# EAGLE design observer (EAGLE 6.6.0)
AUTHOR: Brad Campbell, N. Jackson, C. Kreng; REV: A; TITLE: Observer

## Sheet 1 of 2
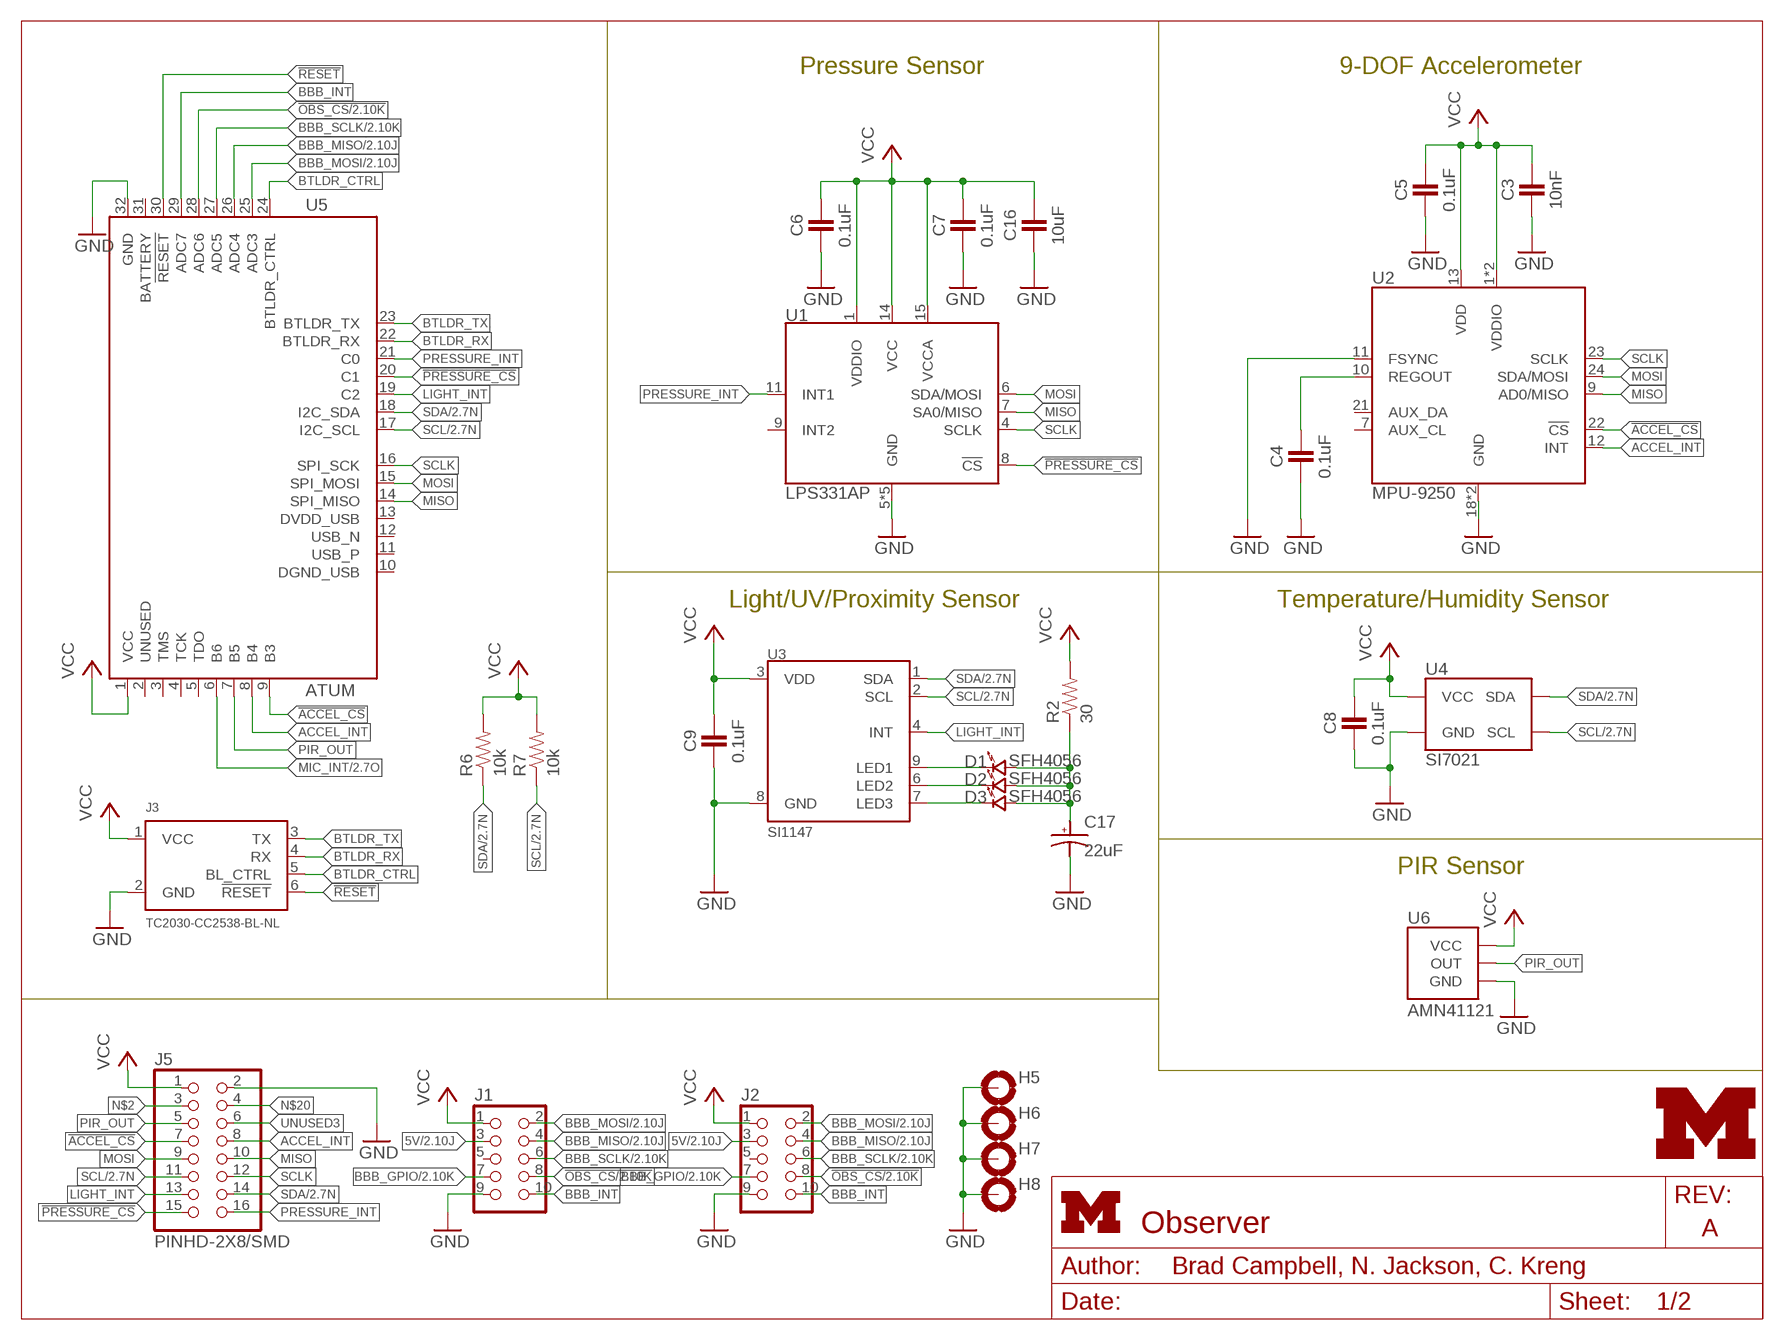
[diagram p0: schematic, sheet 1]
FRAME1 (LETTER_L): HEIGHT: 8.5in; WIDTH: 11in

### Parts
C3  10nF  CAPACITOR  [0402_CAP]
C4  0.1uF  CAPACITOR  [0402_CAP]
C5  0.1uF  CAPACITOR  [0402_CAP]
C6  0.1uF  CAPACITOR  [0402_CAP]
C7  0.1uF  CAPACITOR  [0402_CAP]
C8  0.1uF  CAPACITOR  [0402_CAP]
C9  0.1uF  CAPACITOR  [0402_CAP]
C16  10uF  CAPACITOR  [0402_CAP]
C17  22uF  CAP_POL0603  [CAP0603]
D1  SFH4056  [SFH4056]
D2  SFH4056  [SFH4056]
D3  SFH4056  [SFH4056]
H5  MOUNT-PAD-ROUND3.2  [3,2-PAD]
H6  MOUNT-PAD-ROUND3.2  [3,2-PAD]
H7  MOUNT-PAD-ROUND3.2  [3,2-PAD]
H8  MOUNT-PAD-ROUND3.2  [3,2-PAD]
J1  CON_HEADER_2X05-SMD+SHROUDED  [PINSHRD_SMT_2X05]
J2  CON_HEADER_2X05-SMD+SHROUDED  [PINSHRD_SMT_2X05]
J3  TC2030-CC2538-BL-NL  [TC2030-IDC-NL]
J5  PINHD-2X8/SMD  [2X8/SMD]
LOGO1  UMICH_SOLID_TINY  [UMICH_SOLID_50MIL]
R2  30  RESISTOR0402_RES  [0402_RES]
R6  10k  RESISTOR0402_RES  [0402_RES]
R7  10k  RESISTOR0402_RES  [0402_RES]
U1  LPS331AP  [HCLGA-16/3MM]
U2  MPU-9250  [QFN-24/3MM]
U3  SI1147  [QFN-10/2MM]
U4  SI7021  [DFN-6/3MM]
U5  ATUM  [ATUM]
U6  AMN41121  [AMN2]

### Nets
5V: J1.3 J2.3 ; also sheet 2
!ACCEL_CS: J5.7 U2.22(!CS) U5.9(B3)
!OBS_CS: J1.8 J2.8 U5.28(ADC6) ; also sheet 2
!PRESSURE_CS: J5.15 U1.8(!CS) U5.20(C1)
!RESET: J3.6(!RESET) U5.30(!RESET)
ACCEL_INT: J5.8 U2.12(INT) U5.8(B4)
BBB_GPIO: J1.7 J2.7 ; also sheet 2
BBB_INT: J1.10 J2.10 U5.29(ADC7)
BBB_MISO: J1.4 J2.4 U5.26(ADC4) ; also sheet 2
BBB_MOSI: J1.2 J2.2 U5.25(ADC3) ; also sheet 2
BBB_SCLK: J1.6 J2.6 U5.27(ADC5) ; also sheet 2
BTLDR_CTRL: J3.5(BL_CTRL) U5.24(BTLDR_CTRL)
BTLDR_RX: J3.4(RX) U5.22(BTLDR_RX)
BTLDR_TX: J3.3(TX) U5.23(BTLDR_TX)
GND: C3.2 C4.2 C5.2 C6.2 C7.2 C8.2 C9.2 C16.2 C17.NEG(ANODE) H5.B3,2(MOUNT) H6.B3,2(MOUNT) H7.B3,2(MOUNT) H8.B3,2(MOUNT) J1.9 J2.9 J3.2(GND) J5.2 U1.5(GND) U1.10(GND) U1.12(GND) U1.13(GND) U1.16(GND) U2.11(FSYNC) U2.18(GND) U2.20(GND) U3.8(GND) U4.2(GND) U5.32(GND) U6.GND ; also sheet 2
LIGHT_INT: J5.13 U3.4(INT) U5.19(C2)
MIC_INT: U5.6(B6) ; also sheet 2
MISO: J5.10 U1.7(SA0/MISO) U2.9(AD0/MISO) U5.14(SPI_MISO)
MOSI: J5.9 U1.6(SDA/MOSI) U2.24(SDA/MOSI) U5.15(SPI_MOSI)
N$2: J5.3
N$3: C4.1 U2.10(REGOUT)
N$4: D1.CATHODE U3.9(LED1)
N$6: D2.CATHODE U3.6(LED2)
N$7: D3.CATHODE U3.7(LED3)
N$8: C17.POS(CATHODE) D1.ANODE D2.ANODE D3.ANODE R2.1
N$20: J5.4
PIR_OUT: J5.5 U5.7(B5) U6.OUT
PRESSURE_INT: J5.16 U1.11(INT1) U5.21(C0)
SCL: J5.11 R7.1 U3.2(SCL) U4.6(SCL) U5.17(I2C_SCL) ; also sheet 2
SCLK: J5.12 U1.4(SCLK) U2.23(SCLK) U5.16(SPI_SCK)
SDA: J5.14 R6.1 U3.1(SDA) U4.1(SDA) U5.18(I2C_SDA) ; also sheet 2
UNUSED3: J5.6
VCC: C3.1 C5.1 C6.1 C7.1 C8.1 C9.1 C16.1 J1.1 J2.1 J3.1(VCC) J5.1 R2.2 R6.2 R7.2 U1.1(VDDIO) U1.14(VCC) U1.15(VCCA) U2.1(VDDIO) U2.8(VDDIO) U2.13(VDD) U3.3(VDD) U4.5(VCC) U5.1(VCC) U6.VCC ; also sheet 2
Unconnected: J1.5 J2.5 U1.9(INT2) U2.7(AUX_CL) U2.21(AUX_DA) U5.2(UNUSED) U5.3(TMS) U5.4(TCK) U5.5(TDO) U5.10(DGND_USB) U5.11(USB_P) U5.12(USB_N) U5.13(DVDD_USB) U5.31(BATTERY)

### Notes on the sheet
- Pressure Sensor | 9-DOF Accelerometer
- Light/UV/Proximity Sensor | Temperature/Humidity Sensor
- PIR Sensor

## Sheet 2 of 2
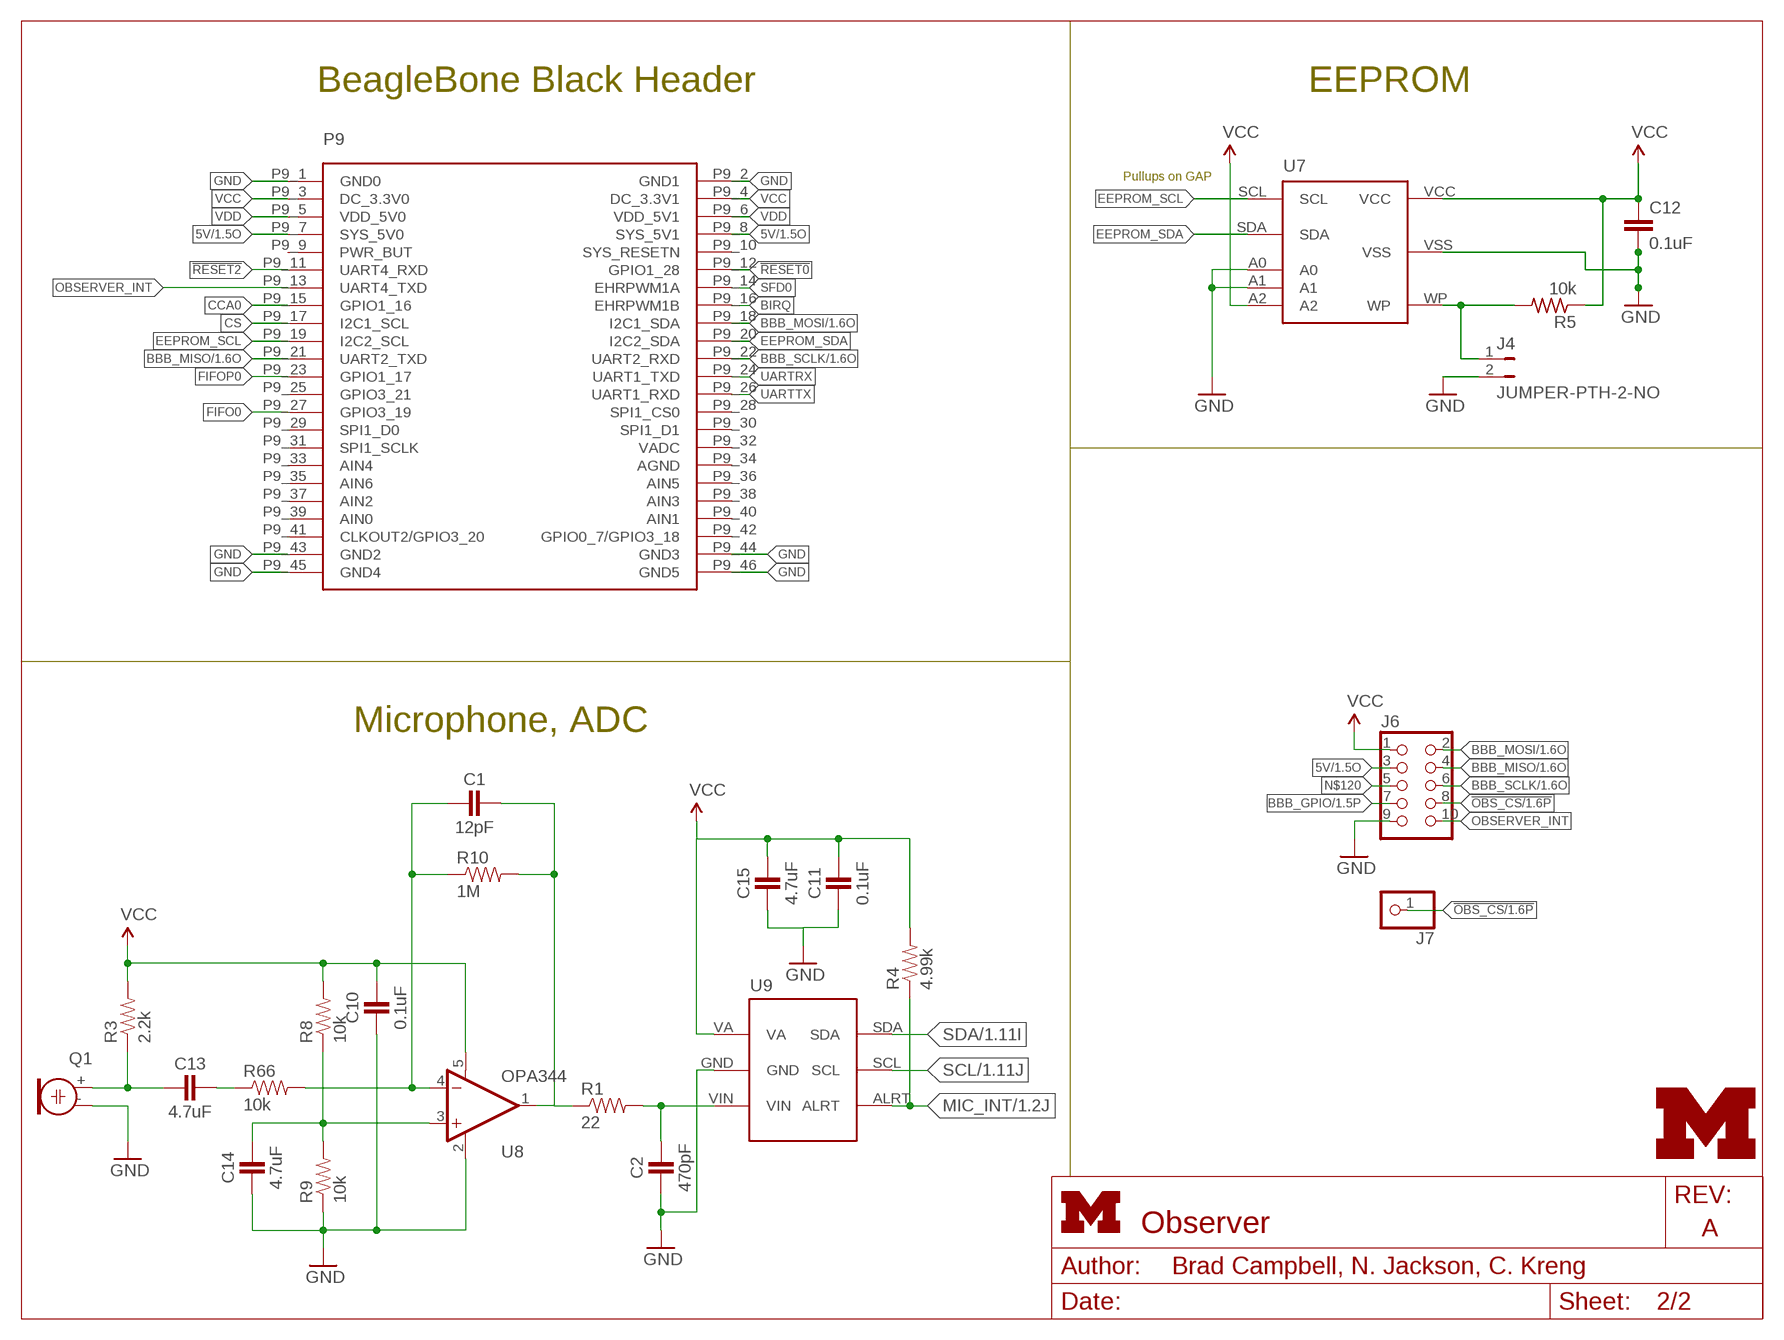
[diagram p1: schematic, sheet 2]
FRAME2 (LETTER_L): HEIGHT: 8.5in; WIDTH: 11in

### Parts
C1  12pF  CAPACITOR  [0402_CAP]
C2  470pF  CAPACITOR  [0402_CAP]
C10  0.1uF  CAPACITOR  [0402_CAP]
C11  0.1uF  CAPACITOR  [0402_CAP]
C12  0.1uF  C-EUC0402  [C0402]
C13  4.7uF  CAPACITOR  [0402_CAP]
C14  4.7uF  CAPACITOR  [0402_CAP]
C15  4.7uF  CAPACITOR  [0402_CAP]
J4  JUMPER-PTH-2-NO  [PTH-JUMPER-2-NO_NO_SILK]
J6  CON_HEADER_2X05-PTH+SHROUDED_A  [PINSHRD_PTH_2X05]
J7  PINHD-1X1  [1X01]
LOGO2  UMICH_SOLID_TINY  [UMICH_SOLID_50MIL]
P9/P8  BBB_HEADER  [BBB_HEADERS]
Q1  ELECTRET  [ELECTRET_9.7]
R1  22  RESISTOR0402_RES  [0402_RES]
R3  2.2k  RESISTOR0402_RES  [0402_RES]
R4  4.99k  RESISTOR0402_RES  [0402_RES]
R5  10k  R-US_R0402  [R0402]
R8  10k  RESISTOR0402_RES  [0402_RES]
R9  10k  RESISTOR0402_RES  [0402_RES]
R10  1M  RESISTOR0402_RES  [0402_RES]
R66  10k  RESISTOR0402_RES  [0402_RES]
U7  CAT24C256WI-GT3  [CAT24C256WI-GT3]
U8  OPA344  [SOT23-5]
U9  ADC121C021  [ADC121C021]

### Nets
5V: J6.3 P9/P8.P9_7(SYS_5V0) P9/P8.P9_8(SYS_5V1) ; also sheet 1
!OBS_CS: J6.8 J7.1 ; also sheet 1
!RESET0: P9/P8.P9_12(GPIO1_28)
!RESET2: P9/P8.P9_11(UART4_RXD)
BBB_GPIO: J6.7 ; also sheet 1
BBB_MISO: J6.4 P9/P8.P9_21(UART2_TXD) ; also sheet 1
BBB_MOSI: J6.2 P9/P8.P9_18(I2C1_SDA) ; also sheet 1
BBB_SCLK: J6.6 P9/P8.P9_22(UART2_RXD) ; also sheet 1
BIRQ: P9/P8.P9_16(EHRPWM1B)
CCA0: P9/P8.P9_15(GPIO1_16)
CS: P9/P8.P9_17(I2C1_SCL)
EEPROM_SCL: P9/P8.P9_19(I2C2_SCL) U7.SCL
EEPROM_SDA: P9/P8.P9_20(I2C2_SDA) U7.SDA
FIFO0: P9/P8.P9_27(GPIO3_19)
FIFOP0: P9/P8.P9_23(GPIO1_17)
GND: C2.2 C10.2 C11.2 C12.2 C14.2 C15.2 J4.2 J6.9 P9/P8.P9_1(GND0) P9/P8.P9_2(GND1) P9/P8.P9_43(GND2) P9/P8.P9_44(GND3) P9/P8.P9_45(GND4) P9/P8.P9_46(GND5) Q1.- R9.1 U7.A0 U7.A1 U7.VSS U8.2(V-) U9.GND ; also sheet 1
MIC_AIN: C1.1 R1.1 R10.2 U8.1(OUT)
MIC_INT: R4.1 U9.ALRT ; also sheet 1
N$1: C13.2 Q1.+ R3.1
N$5: C13.1 R66.1
N$9: C1.2 R10.1 R66.2 U8.4(-IN)
N$10: C14.1 R8.1 R9.2 U8.3(+IN)
N$11: C2.1 R1.2 U9.VIN
N$31: J4.1 R5.2 U7.WP
N$120: J6.5
OBSERVER_INT: J6.10 P9/P8.P9_13(UART4_TXD)
SCL: U9.SCL ; also sheet 1
SDA: U9.SDA ; also sheet 1
SFD0: P9/P8.P9_14(EHRPWM1A)
UARTRX: P9/P8.P9_24(UART1_TXD)
UARTTX: P9/P8.P9_26(UART1_RXD)
VCC: C10.1 C11.1 C12.1 C15.1 J6.1 P9/P8.P9_3(DC_3.3V0) P9/P8.P9_4(DC_3.3V1) R3.2 R4.2 R5.1 R8.2 U7.A2 U7.VCC U8.5(V+) U9.VA ; also sheet 1
VDD: P9/P8.P9_5(VDD_5V0) P9/P8.P9_6(VDD_5V1)
Unconnected: P9/P8.P9_9(PWR_BUT) P9/P8.P9_10(SYS_RESETN) P9/P8.P9_25(GPIO3_21) P9/P8.P9_28(SPI1_CS0) P9/P8.P9_29(SPI1_D0) P9/P8.P9_30(SPI1_D1) P9/P8.P9_31(SPI1_SCLK) P9/P8.P9_32(VADC) P9/P8.P9_33(AIN4) P9/P8.P9_34(AGND) P9/P8.P9_35(AIN6) P9/P8.P9_36(AIN5) P9/P8.P9_37(AIN2) P9/P8.P9_38(AIN3) P9/P8.P9_39(AIN0) P9/P8.P9_40(AIN1) P9/P8.P9_41(CLKOUT2/GPIO3_20) P9/P8.P9_42(GPIO0_7/GPIO3_18)

### Notes on the sheet
- BeagleBone Black Header | EEPROM
- Pullups on GAP
- Microphone, ADC

## Library data of the parts
C1 C2 C10 C11 C13-C15 = passives:CAPACITOR: 0402 Capacitor
C3 = passives:CAPACITOR: 0402 Capacitor; DIGIKEY: 490-1312-1-ND
C4-C9 = passives:CAPACITOR: 0402 Capacitor; DIGIKEY: 490-1318-1-ND
C12 = rcl:C-EU: CAPACITOR, European symbol; DIGIKEY: 490-1318-1-ND
C16 = passives:CAPACITOR: 0402 Capacitor; DIGIKEY: 445-8919-1-ND
C17 = passives:CAP_POL; DIGIKEY: 511-1493-1-ND
D1-D3 = leds:SFH4056: LED IR EMITTER 850NM; DIGIKEY: 475-3042-1-ND
H5-H8 = holes:MOUNT-PAD-ROUND: MOUNTING PAD, round
J1 J2 = dp_devices:CON_HEADER_2X05: 2x05 pin header; DIGIKEY: S9185-ND
J3 = connector:TC2030-CC2538-BL: Tag connect programmer for the CC2538 bootloader. The RX/TX switch happens on the programmer board, so when using this connect the TX pin to the TX pin on the CC2538 and same for the RX.
J4 = SparkFun-Passives:JUMPER-PTH-2-NO
J5 = headers:PINHD-2X8/SMD
J6 = dp_devices:CON_HEADER_2X05: 2x05 pin header
J7 = pinhead:PINHD-1X1: PIN HEADER
LOGO1 LOGO2 = logos:UMICH_SOLID
P9/P8 = observer:BBB_HEADER: Beaglebone Black P9 Pin Header 2x23
Q1 = observer:ELECTRET: Electret microphone Thru hole 2.54mm spacing with 9.7mm diameter
R1 R3 R4 R8-R10 R66 = passives:RESISTOR: Resistor Basic schematic elements and footprints for 0603, 1206, and PTH resistors.
R2 = passives:RESISTOR: Resistor Basic schematic elements and footprints for 0603, 1206, and PTH resistors.; DIGIKEY: RHM30CECT-ND
R5 = rcl:R-US_: RESISTOR, American symbol; DIGIKEY: RHM1.00MCDCT-ND
R6 R7 = passives:RESISTOR: Resistor Basic schematic elements and footprints for 0603, 1206, and PTH resistors.; DIGIKEY: RHM10.0KCDCT-ND
U1 = chips:LPS331AP: IC PRESSURE SENSOR PIEZO 16HCLGA; DIGIKEY: 497-12927-1-ND
U2 = chips:MPU-9250: GYRO/ACCEL/COMPASS/9-AXIS; DIGIKEY: 1428-1019-1-ND
U3 = chips:SI1147: SENSOR DGTL UV INDEX 10QFN; DIGIKEY: 336-2624-1-ND
U4 = chips:SI7021: IC TEMP SENSOR RH 2% DFN; DIGIKEY: 336-2542-1-ND
U5 = atum:ATUM: Atum sensorboard prototyping module.
U6 = chips:AMN: Passive infrared human detection sensor with built-in amp.; DIGIKEY: 255-2651-ND
U7 = bbb-cc2520:CAT24C256: 256kb Serial CMOS EEPROM, organized as 32,768 words of 8 bits each
U8 = SparkFun-AnalogIC:OPA344: Single gate rail-to-rail output op-amp. Inputs extend 300mV past rails.
U9 = observer:ADC121C021

## Board
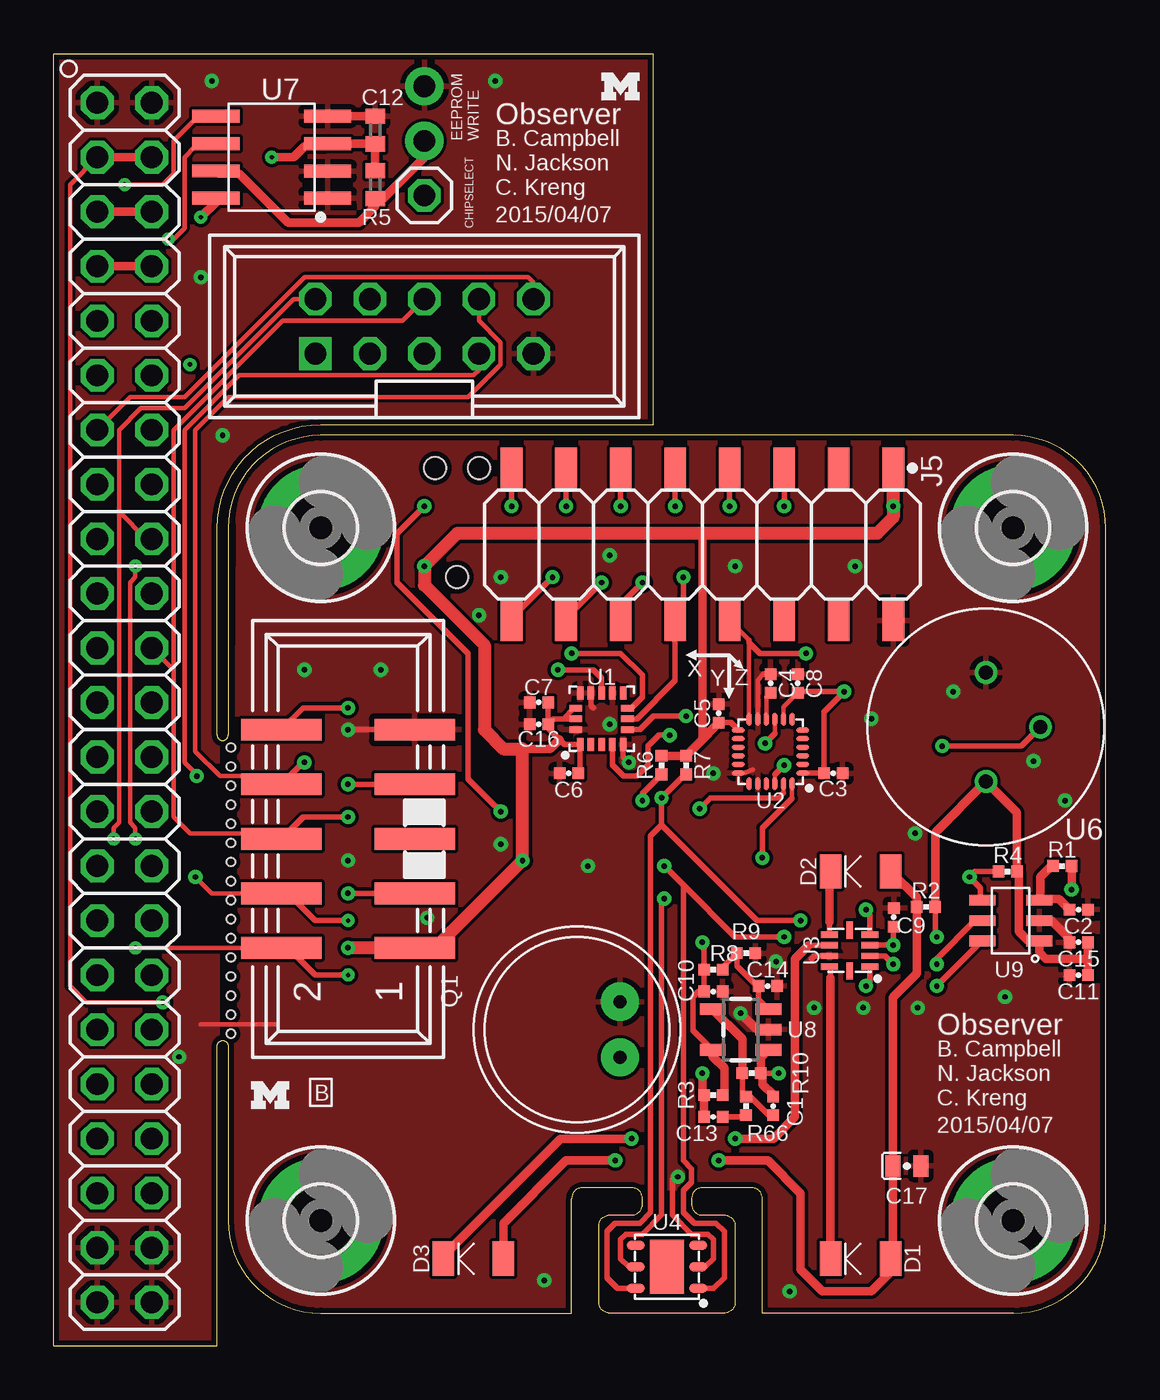
[diagram p2: board, top side]
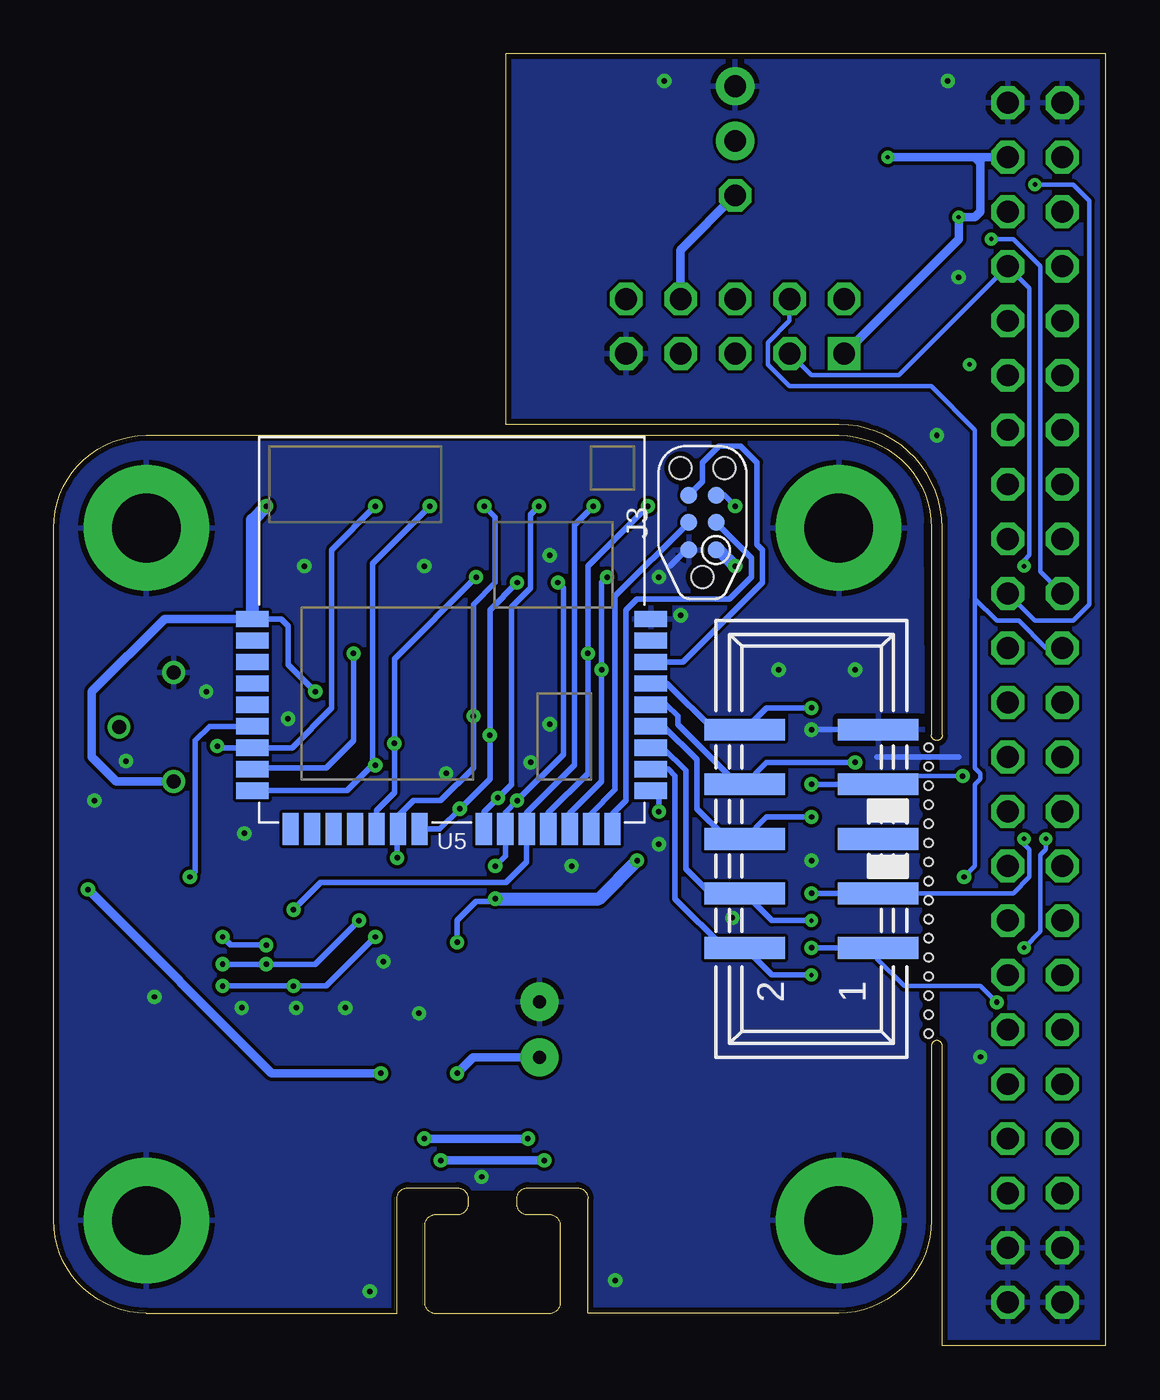
[diagram p3: board, bottom side, seen from below]

Size 49.02 x 60.2 mm. Coordinates in mm from the lower left corner, seen from the top.
Outline: 49.02,5.84 49.02,38.1 arc90 44.7,42.42 12.45,42.42 arc90 8.13,38.1 8.13,28.45 arc-180 7.62,28.45 7.62,38.1 arc-90 12.45,42.93 27.94,42.93 27.94,60.2 0,60.2 0,0 7.62,0 7.62,13.97 arc-180 8.13,13.97 8.13,5.84 arc90 12.45,1.52 24.13,1.52 24.13,6.86 arc-90 24.64,7.37 26.92,7.37 arc-90 27.43,6.86 27.43,6.6 arc-90 26.92,6.1 25.91,6.1 arc90 25.4,5.59 25.4,2.03 arc90 25.91,1.52 31.24,1.52 arc90 31.75,2.03 31.75,5.59 arc90 31.24,6.1 30.23,6.1 arc-90 29.72,6.6 29.72,6.86 arc-90 30.23,7.37 32.51,7.37 arc-90 33.02,6.86 33.02,1.52 44.7,1.52 arc90 49.02,5.84
Copper layers (1*16): Top 0.0178mm / dielectric 59mil / Bottom 0.0178mm
Design rules "sunstone-2lyr_v1.0.0.3 *": minimum track width 6mil, minimum drill 14mil, track to track 6mil, track to pad 6mil, pad to pad 6mil, via to via 6mil, smd to smd 6mil, copper to edge 10mil, drill to drill 16mil, minimum pad ring 8mil, minimum via ring 8mil, stop-mask expansion 3mil, vias tented up to drill 15mil, thermal gap 10mil
Holes 0.38 mm at 8.26,27.88 8.26,26.99 8.26,26.1 8.26,25.21 8.26,24.32 8.26,23.43 8.26,22.54 8.26,21.65 8.26,20.76 8.26,19.88 8.26,18.99 8.26,18.1 8.26,17.21 8.26,16.32 8.26,15.43 8.26,14.54

### Footprints (pad centres in the part's own frame; a part is rotated, then mirrored left to right if it is on the bottom)
0402_CAP = smd 0.536 x 0.546: 1 -0.433,0; 2 0.433,0
C0402 = smd 0.7 x 0.9: 1 -0.65,0; 2 0.65,0
CAP0603 = smd 0.7 x 1: NEG 0.65,0; POS -0.65,0
SFH4056 = smd 1 x 1.6: ANODE 1.4,0; CATHODE -1.4,0
3,2-PAD = drill 3.2 pad 5.842: B3,2 0,0
PINSHRD_SMT_2X05 = smd 1.02 x 3.75: 1 -5.08,-3.107; 2 -5.08,3.107; 3 -2.54,-3.107; 4 -2.54,3.107; 5 0,-3.107; 6 0,3.107; 7 2.54,-3.107; 8 2.54,3.107; 9 5.08,-3.107; 10 5.08,3.107
TC2030-IDC-NL = smd 0.787 x 0.787: 1 -1.27,-0.635; 2 -1.27,0.635; 3 0,-0.635; 4 0,0.635; 5 1.27,-0.635; 6 1.27,0.635 | hole 1.016: -2.54,0; 2.54,1.016; 2.54,-1.016
PTH-JUMPER-2-NO_NO_SILK = drill 1.016 pad 1.778: 1 -1.27,0; 2 1.27,0
2X8/SMD = smd 1.016 x 1.905: 1 -8.89,-3.556; 2 -8.89,3.556; 3 -6.35,-3.556; 4 -6.35,3.556; 5 -3.81,-3.556; 6 -3.81,3.556; 7 -1.27,-3.556; 8 -1.27,3.556; 9 1.27,-3.556; 10 1.27,3.556; 11 3.81,-3.556; 12 3.81,3.556; 13 6.35,-3.556; 14 6.35,3.556; 15 8.89,-3.556; 16 8.89,3.556
PINSHRD_PTH_2X05 = drill 1.016 square: 1 -5.08,-1.27 | drill 1.016 octagon: 2 -5.08,1.27; 3 -2.54,-1.27; 4 -2.54,1.27; 5 0,-1.27; 6 0,1.27; 7 2.54,-1.27; 8 2.54,1.27; 9 5.08,-1.27; 10 5.08,1.27
1X01 = drill 1.016 octagon: 1 0,0
BBB_HEADERS = drill 1.016 octagon: P9_1 1.27,57.15; P9_2 3.81,57.15; P9_3 1.27,54.61; P9_4 3.81,54.61; P9_5 1.27,52.07; P9_6 3.81,52.07; P9_7 1.27,49.53; P9_8 3.81,49.53; P9_9 1.27,46.99; P9_10 3.81,46.99; P9_11 1.27,44.45; P9_12 3.81,44.45; P9_13 1.27,41.91; P9_14 3.81,41.91; P9_15 1.27,39.37; P9_16 3.81,39.37; P9_17 1.27,36.83; P9_18 3.81,36.83; P9_19 1.27,34.29; P9_20 3.81,34.29; P9_21 1.27,31.75; P9_22 3.81,31.75; P9_23 1.27,29.21; P9_24 3.81,29.21; P9_25 1.27,26.67; P9_26 3.81,26.67; P9_27 1.27,24.13; P9_28 3.81,24.13; P9_29 1.27,21.59; P9_30 3.81,21.59; P9_31 1.27,19.05; P9_32 3.81,19.05; P9_33 1.27,16.51; P9_34 3.81,16.51; P9_35 1.27,13.97; P9_36 3.81,13.97; P9_37 1.27,11.43; P9_38 3.81,11.43; P9_39 1.27,8.89; P9_40 3.81,8.89; P9_41 1.27,6.35; P9_42 3.81,6.35; P9_43 1.27,3.81; P9_44 3.81,3.81; P9_45 1.27,1.27; P9_46 3.81,1.27
ELECTRET_9.7 = drill 0.6 pad 1.778: + 1.3,2; - -1.3,2
0402_RES = smd 0.536 x 0.546: 1 -0.433,0; 2 0.433,0
R0402 = smd 0.7 x 0.9: 1 -0.65,0; 2 0.65,0
HCLGA-16/3MM = smd 0.6 x 0.3: 1 -1.2,1; 2 -1.2,0.5; 3 -1.2,0; 4 -1.2,-0.5; 5 -1.2,-1; 9 1.2,-1; 10 1.2,-0.5; 11 1.2,0; 12 1.2,0.5; 13 1.2,1 | smd 0.3 x 0.6: 6 -0.5,-1.2; 7 0,-1.2; 8 0.5,-1.2; 14 0.5,1.2; 15 0,1.2; 16 -0.5,1.2
QFN-24/3MM = smd 0.6 x 0.23: 1 -1.5,1; 2 -1.5,0.6; 3 -1.5,0.2; 4 -1.5,-0.2; 5 -1.5,-0.6; 6 -1.5,-1; 13 1.5,-1; 14 1.5,-0.6; 15 1.5,-0.2; 16 1.5,0.2; 17 1.5,0.6; 18 1.5,1 | smd 0.23 x 0.6: 7 -1,-1.5; 8 -0.6,-1.5; 9 -0.2,-1.5; 10 0.2,-1.5; 11 0.6,-1.5; 12 1,-1.5; 19 1,1.5; 20 0.6,1.5; 21 0.2,1.5; 22 -0.2,1.5; 23 -0.6,1.5; 24 -1,1.5
QFN-10/2MM = smd 0.8 x 0.3: 1 -0.95,0.75; 2 -0.95,0.25; 3 -0.95,-0.25; 4 -0.95,-0.75; 6 0.95,-0.75; 7 0.95,-0.25; 8 0.95,0.25; 9 0.95,0.75 | smd 0.3 x 0.8: 5 0,-0.95; 10 0,0.95
DFN-6/3MM = smd 0.85 x 0.45: 1 -1.45,1; 2 -1.45,0; 3 -1.45,-1; 4 1.45,-1; 5 1.45,0; 6 1.45,1 | smd 1.6 x 2.5: P$1 0,0
ATUM = smd 0.754 x 1.5: 1 -9.479,-9.279; 2 -8.479,-9.279; 3 -7.479,-9.279; 4 -6.479,-9.279; 5 -5.479,-9.279; 6 -4.479,-9.279; 7 -3.479,-9.279; 8 -2.479,-9.279; 9 -1.479,-9.279; 24 -1.479,9.279; 25 -2.479,9.279; 26 -3.479,9.279; 27 -4.479,9.279; 28 -5.479,9.279; 29 -6.479,9.279; 30 -7.479,9.279; 31 -8.479,9.279; 32 -9.479,9.279 | smd 1.5 x 0.754: 10 0.3,-7.5; 11 0.3,-6.5; 12 0.3,-5.5; 13 0.3,-4.5; 14 0.3,-3.5; 15 0.3,-2.5; 16 0.3,-1.5; 17 0.3,1.5; 18 0.3,2.5; 19 0.3,3.5; 20 0.3,4.5; 21 0.3,5.5; 22 0.3,6.5; 23 0.3,7.5
AMN2 = drill 0.65: GND 1.796,-1.796; OUT -1.796,-1.796; VCC -1.796,1.796
CAT24C256WI-GT3 = smd 2.2 x 0.6: A0 -2.6,1.91; A1 -2.6,0.65; A2 -2.6,-0.64; SCL 2.6,-0.64; SDA 2.6,-1.91; VCC 2.6,1.91; VSS -2.6,-1.91; WP 2.6,0.64
SOT23-5 = smd 0.55 x 1.2: 1 -0.95,-1.3; 2 0,-1.3; 3 0.95,-1.3; 4 0.95,1.3; 5 -0.95,1.3
ADC121C021 = smd 1.2 x 0.5: ALRT 2.2,0.575; GND -0.45,1.525; SCL 2.2,1.525; SDA 2.2,2.475; VA -0.45,2.475; VIN -0.45,0.575

### Placement (x,y rotation side)
C1  33.53,11.18 270 top
C2  47.75,20.32 0 top
C3  36.32,26.67 0 top
C4  33.4,30.86 90 top
C5  30.99,29.46 90 top
C6  24,26.67 180 top
C7  22.61,29.97 180 top
C8  34.67,30.86 90 top
C9  39.14,19.96 90 top
C10  30.73,16.51 0 top
C11  47.75,17.27 180 top
C12  14.99,56.64 90 top
C13  30.73,10.67 180 top
C14  33.27,16.76 0 top
C15  47.75,18.8 180 top
C16  22.61,28.96 180 top
C17  39.75,8.38 0 top
D1  37.59,4.06 0 top
D2  37.59,22.1 0 top
D3  19.56,4.06 0 top
H5  44.7,38.1 180 top
H6  44.7,5.84 180 top
H7  12.45,5.84 180 top
H8  12.45,38.1 0 top
J1  13.72,23.62 90 bottom
J2  13.72,23.62 90 top
J3  18.8,38.35 90 bottom
J4  17.27,57.4 90 top
J5  30.23,37.34 180 top
J6  17.27,47.5 0 top
J7  17.27,53.59 0 top
LOGO1  10.08,11.68 0 top
LOGO2  26.42,58.67 0 top
P9/P8  0.76,0.76 0 top
Q1  24.38,14.73 270 top
R1  46.99,22.35 180 top
R2  40.64,20.45 0 top
R3  30.73,11.68 0 top
R4  44.45,22.1 0 top
R5  14.99,54.1 270 top
R6  28.32,27.05 90 top
R7  29.46,27.05 90 top
R8  30.73,17.53 180 top
R9  32.26,18.29 180 top
R10  32.51,12.7 0 top
R66  32.26,11.18 90 top
U1  25.53,29.21 90 top
U2  33.4,27.69 180 top
U3  37.08,18.41 180 top
U4  28.57,3.68 180 top
U5  30.48,24.38 270 bottom
U6  43.43,28.83 135 top
U7  10.16,55.37 180 top
U8  32,14.73 90 top
U9  45.47,21.34 180 top

### Tracks (layer width: path | path; a pad name or v marks a point on that pad's centre or on a via)
5V  (via drill 0.2, 0.25)
  Top 0.203: v3.81,36.32 3.81,35.81 3.56,35.56 3.56,24.38 3.81,24.13 v3.81,23.62
  Top 0.254: J2.3 v13.72,21.08
  Top 0.406: P9/P8.P9_7 P9/P8.P9_8
  Bottom 0.203: J6.3 13.72,45.21 9.65,45.21 P9/P8.P9_8 3.56,49.28 3.56,36.83 3.81,36.58 v3.81,36.32 | v3.81,23.62 3.81,23.37 3.56,23.11 3.56,21.84 4.32,21.08 8.89,21.08 9.02,21.21 10.48,21.21 J1.3
  Bottom 0.254: v13.72,21.08 J1.3
!ACCEL_CS  (via drill 0.25)
  Top 0.203: 33.6,26.62 U2.22
  Top 0.254: 33.6,26.62 v34.04,27.05 | J5.7 v31.5,39.12
  Bottom 0.254: U5.9 35.35,25.86 34.16,27.05 | v34.04,27.05 34.16,27.05 | 34.16,27.05 34.16,36.45 v31.5,39.12
!OBS_CS  (via drill 0.25)
  Top 0.203: J6.8 19.81,47.75 20.83,46.74 20.83,45.72 19.3,44.2 8.13,44.2 6.6,42.67 6.6,27.69 7.75,26.54 10.23,26.54 J2.8
  Top 0.254: 10.41,26.16 J2.8 11.62,27.18 v11.68,27.18
  Bottom 0.254: U5.28 20.46,29.86 19.94,29.34 19.94,28.96 17.14,26.16 J1.8 15.81,27.18 v11.68,27.18
  Bottom 0.406: J6.8 19.81,51.05 J7.1
!PRESSURE_CS  (via drill 0.25)
  Top 0.254: v24.13,32.26 26.42,32.26 27.43,31.24 27.43,30.23 26.92,29.71 U1.8 | J5.15 v21.34,39.12
  Bottom 0.254: U5.20 25.98,24.82 24.13,26.67 v24.13,32.26 24.13,36.32 v21.34,39.12
!RESET
  Bottom 0.254: J3.6 18.8,40.26 18.8,41.15 18.03,41.91 17.02,41.91 16.26,41.15 16.26,37.34 16,37.08 16,35.56 19.7,31.86 U5.30
ACCEL_INT  (via drill 0.25)
  Top 0.203: U2.12 32.4,32.77 | 32.4,32.88 J5.8
  Top 0.254: 32.4,32.88 32.4,32.77 32.91,32.26 v35.05,32.26
  Bottom 0.254: v35.05,32.26 35.05,28.19 36.32,26.92 39.7,26.92 U5.8
BBB_GPIO  (via drill 0.25)
  Top 0.203: J6.7 19.81,45.47 19.56,45.21 8.64,45.21 6.1,42.67 6.1,27.18 6.67,26.61 v6.67,26.54
  Top 0.254: J2.7 v13.72,26.16
  Bottom 0.203: J1.7 10.23,26.54 10.1,26.42 9.4,26.42 9.27,26.54 v6.67,26.54
  Bottom 0.254: v13.72,26.16 J1.7
BBB_INT  (via drill 0.25)
  Top 0.254: v13.72,29.72 11.62,29.72 J2.10
  Bottom 0.254: v13.72,29.72 15.81,29.72 J1.10 18.29,28.7 20.45,30.86 U5.29
BBB_MISO  (via drill 0.2, 0.25)
  Top 0.203: J2.4 7.37,21.08 v6.6,21.84
  Top 0.254: J2.4 10.92,21.08 12.19,19.81 v13.72,19.81
  Bottom 0.203: J6.4 14.73,47.75 15.75,46.74 15.75,45.72 14.73,44.7 8.13,44.7 6.1,42.67 6.1,34.8 | P9/P8.P9_21 2.79,32.51 4.06,33.78 5.08,33.78 6.1,34.8 | v6.6,21.84 6.1,22.35 6.1,26.16 5.84,26.42 5.84,26.67 6.1,26.92 6.1,34.8
  Bottom 0.254: U5.26 20.62,27.86 19.56,26.8 19.56,22.23 18.41,21.08 J1.4 15.55,19.81 v13.72,19.81
BBB_MOSI  (via drill 0.2)
  Top 0.203: J6.2 11.18,48.77 6.1,43.69 4.06,43.69 3.05,42.67 3.05,38.86 | v3.81,18.54 J2.2 | v2.79,23.62 2.79,24.13 3.05,24.38 3.05,38.86 | P9/P8.P9_18 4.32,37.59 3.05,38.86
  Top 0.254: J2.2 10.92,18.54 12.19,17.27 v13.72,17.27
  Bottom 0.203: v3.81,18.54 3.05,19.3 3.05,22.86 2.79,23.11 v2.79,23.62
  Bottom 0.254: U5.25 20.39,26.86 20.07,26.54 20.07,20.83 17.78,18.54 J1.2 15.55,17.27 v13.72,17.27
BBB_SCLK  (via drill 0.25)
  Top 0.203: 11.62,24.64 11.62,24.58 10.67,23.62 | 5.59,31.5 P9/P8.P9_22 | J6.6 16.26,47.75 10.67,47.75 5.59,42.67 5.59,31.5 | J2.6 10.35,23.88 6.35,23.88 5.59,24.64 5.59,31.5
  Top 0.254: J2.6 11.62,24.64 v13.72,24.64
  Bottom 0.254: U5.27 20.61,28.86 19.05,27.3 19.05,25.02 17.78,23.75 17.78,23.62 J1.6 15.81,24.64 v13.72,24.64
BTLDR_CTRL  (via drill 0.25)
  Top 0.254: v20.83,24.89 19.3,26.42 19.3,32.26 16,35.56 16,37.85 v17.27,39.12
  Bottom 0.254: U5.24 20.83,25.49 v20.83,24.89 | v17.27,39.12 17.78,39.62 J3.5
BTLDR_RX
  Bottom 0.254: U5.22 23.98,24.79 22.86,25.91 22.86,34.92 J3.4
BTLDR_TX
  Bottom 0.254: J3.3 16.51,36.7 16.51,35.81 17.53,34.8 21.84,34.8 22.35,34.29 22.35,25.4 22.98,24.77 U5.23
EEPROM_SCL  (via drill 0.2)
  Top 0.203: 7.69,55.88 U7.SCL | 7.68,56.13 U7.SCL | v5.33,51.56 5.59,51.56 6.1,52.07 6.1,55.37 6.6,55.88 7.43,55.88 U7.SCL
  Bottom 0.203: P9/P8.P9_19 3.05,36.07 3.05,50.29 4.32,51.56 v5.33,51.56
EEPROM_SDA  (via drill 0.2)
  Top 0.203: U7.SDA 7.44,57.4 6.86,57.4 5.59,56.13 5.59,54.61 5.08,54.1 v3.3,54.1
  Bottom 0.203: P9/P8.P9_20 3.3,33.78 1.52,33.78 0.76,34.54 0.76,53.34 1.52,54.1 v3.3,54.1
GND  (via drill 0.25)
  Top 0.203: U2.11 32.8,31.02 33.07,31.29 | U2.18 32.26,26.72 32.59,26.85 | P9/P8.P9_44 4.57,5.08 | 6.86,14.99 10.41,14.99
  Top 0.254: U4.2 30.35,3.68 30.73,4.06 30.73,4.95 30.48,5.21 29.72,5.21 28.83,6.1 28.83,7.75 | J2.9 v13.72,28.7 | 33.07,31.29 C4.2 | U1.5 26.53,27.45 v26.8,27.18 | U1.12 25.03,29.84 25.15,29.72 | U3.8 35.44,18.16 35.31,18.03
  Top 0.406: U7.VSS 14.98,57.28 C12.2 | U9.GND 46.48,19.81 47.32,18.98 C15.2 | U8.2 32.77,14.73 v32,15.49
  Bottom 0.254: v13.72,28.7 J1.9 | J3.2 19.56,37.08 20.32,36.32 | 10.67,27.43 6.86,27.43
  other vias: 25.91,28.96 41.91,30.48 38.1,29.21 30.73,26.67 19.81,34.04 25.91,36.83 20.83,35.81 15.24,31.5 29.08,7.87 35.43,15.75 37.72,15.75 11.68,31.5 22.86,3.05 34.29,2.54 40.13,23.88 24.89,22.35 31.75,36.32 37.34,36.32 20.83,23.37 17.4,19.94 33.66,17.91 6.86,49.78 20.57,58.93 7.37,58.93 40.26,15.75 47.12,25.4 45.66,27.24 13.72,22.61 7.87,42.42 5.84,13.46 44.32,16.26
  pour Bottom: 49.02,1.52 33.02,1.52 33.02,7.37 24.13,7.37 24.13,1.52 8.38,1.52 8.61,38.13 arc-90 12.42,42.42 12.45,42.42 49.02,42.67
  pour Top: 49.02,1.52 33.02,1.52 33.02,7.37 24.13,7.37 24.13,1.52 8.38,1.52 8.61,38.13 arc-90 12.42,42.42 12.45,42.42 49.02,42.67
  pour Bottom: 27.94,42.93 12.19,42.93 arc90 7.62,38.35 7.62,0 0,0 0,60.45 27.94,60.45
  pour Top: 27.94,42.93 12.19,42.93 arc90 7.62,38.35 7.62,0 0,0 0,60.45 27.94,60.45
LIGHT_INT  (via drill 0.25)
  Top 0.254: J5.13 v23.88,39.12 | v37.85,20.32 38.03,20.13 U3.4
  Bottom 0.254: v23.88,39.12 24.77,38.23 24.77,27.05 26.98,24.84 U5.19 26.98,22.55 27.94,21.59 36.58,21.59 v37.85,20.32
MIC_AIN  (via drill 0.25)
  Top 0.254: R10.2 v33.78,12.7
  Top 0.406: C1.1 33.53,11.68 33.02,12.19 33.02,12.62 R10.2 32.95,13.42 U8.1 | v47.42,21.26 R1.1
  Bottom 0.406: v33.78,12.7 38.86,12.7 v47.42,21.26 47.5,21.34
MIC_INT  (via drill 0.25)
  Top 0.254: U9.ALRT 43.18,20.85 43.18,21.34 v42.67,21.84 42.93,22.1 R4.1
  Bottom 0.254: U5.6 41.75,28.86 42.42,28.19 42.42,22.1 v42.67,21.84
MISO  (via drill 0.25)
  Top 0.203: U2.9 33.6,28.52
  Top 0.254: 33.6,28.52 v33.15,28.07 | v29.34,35.81 29.34,34.16 J5.10 28.96,30.99 27.18,29.21 U1.7
  Bottom 0.254: U5.14 33.98,24.95 33.15,25.78 v33.15,28.07 33.15,32 v29.34,35.81
MOSI  (via drill 0.25)
  Top 0.203: 34.4,25.51 U2.24
  Top 0.254: 34.4,25.51 33.02,24.13 v33.02,22.73 | J5.9 v28.96,39.12 | U1.6 27.31,28.71 27.94,29.34 v29.46,29.34
  Bottom 0.254: v33.02,22.73 33.02,24.04 U5.15 32.98,24.68 32.26,25.4 30.99,25.4 29.46,26.92 v29.46,29.34 29.46,34.54 28.45,35.56 28.45,38.61 v28.96,39.12
N$1  (via drill 0.25)
  Top 0.406: v30.23,12.7 30.23,11.76 R3.1 C13.2
  Bottom 0.406: Q1.+ 29.49,13.43 v30.23,12.7
N$3
  Top 0.203: C4.1 33.2,30.25 U2.10
N$4
  Top 0.254: 36.19,17.15 36.19,17.61 U3.9
  Top 0.406: D1.CATHODE 36.19,17.15
N$5
  Top 0.254: C13.1 32.18,10.67 R66.1
N$6
  Top 0.254: 36.13,19.75 U3.6
  Top 0.406: D2.CATHODE 36.13,22.04 36.13,19.75
N$7  (via drill 0.25)
  Top 0.254: 35.17,18.66 U3.7
  Top 0.406: D3.CATHODE 18.16,4.19 23.62,9.65 v26.92,9.65 | v31.75,9.65 33.53,9.65 34.54,10.67 34.54,18.03 35.17,18.66
  Bottom 0.406: v26.92,9.65 v31.75,9.65
N$8  (via drill 0.25)
  Top 0.406: v26.16,8.64 23.88,8.64 20.96,5.72 D3.ANODE | v30.99,8.64 33.27,8.64 34.8,7.11 34.8,3.56 35.81,2.54 38.1,2.54 38.99,3.43 D1.ANODE 39.1,4.17 C17.POS 39.1,16.24 40.21,17.35 R2.1 40.21,20.88 D2.ANODE
  Bottom 0.406: v26.16,8.64 v30.99,8.64
N$9
  Top 0.254: 33.38,10.74 C1.2 33.33,10.74 32.46,11.61 R66.2 32.08,11.79 R10.1
  Top 0.406: R10.1 32.08,14.31 U8.4
N$10
  Top 0.254: U8.3 32.84,16.14 C14.1 32.77,16.76 31.82,17.7 R9.2 31.17,17.63 R8.1
N$11
  Top 0.406: R1.2 46.48,22.35 45.97,21.84 45.97,20.82 | 45.97,20.82 U9.VIN | 45.97,20.82 46.82,20.82 C2.1
N$31
  Top 0.406: U7.WP 7.68,54.61 8.64,54.61 10.92,52.32 14.22,52.32 14.99,53.09 R5.2 15.35,53.45 17.27,55.37 J4.1
NAME  (via drill 0.2)
  other vias: 6.35,45.72
OBSERVER_INT
  Top 0.203: J6.10 22.35,49.53 22.1,49.78 11.68,49.78 6.1,44.2 3.56,44.2 P9/P8.P9_13
PIR_OUT  (via drill 0.25)
  Top 0.254: v34.04,39.12 J5.5 | v41.4,27.94 45.09,27.94 U6.OUT
  Bottom 0.254: v34.04,39.12 36.07,37.08 36.07,29.72 37.92,27.86 U5.7 41.33,27.86 v41.4,27.94
PRESSURE_INT  (via drill 0.25)
  Top 0.254: U1.11 25.53,31.11 25.15,31.5 v23.5,31.5 | v23.24,35.81 21.34,33.91 J5.16
  Bottom 0.254: U5.21 24.98,24.8 23.5,26.29 v23.5,31.5 23.5,35.56 v23.24,35.81
SCL  (via drill 0.25)
  Top 0.254: U4.6 26.27,2.68 25.78,3.17 25.78,5.33 26.16,5.71 27.3,5.71 27.81,6.22 27.81,23.75 28.32,24.26 | R7.1 29.46,26.67 v28.32,25.53 28.32,24.26 | J5.11 v26.42,39.12 | 28.32,24.26 32.77,19.81 v34.8,19.81 | v39.12,17.78 38.73,18.16 U3.2 | U9.SCL 42.92,19.81 41.15,18.03 v41.15,17.78
  Bottom 0.254: U5.17 28.98,24.87 v28.32,25.53 27.69,26.16 27.69,34.42 26.8,35.31 26.8,38.73 v26.42,39.12 | v34.8,19.81 36.83,17.78 v39.12,17.78 v41.15,17.78
SCLK  (via drill 0.25)
  Top 0.203: 34,25.75 U2.23
  Top 0.254: 34,25.75 33.78,25.53 30.61,25.53 v30.1,25.02 | J5.12 26.42,34.54 v27.43,35.56 | U1.4 26.03,27.06 26.54,26.54 27.18,26.54 27.69,27.05 27.69,27.94 28.19,28.45 v28.7,28.45
  Bottom 0.254: U5.16 31.03,24.08 v30.1,25.02 28.7,26.42 v28.7,28.45 28.7,34.29 v27.43,35.56
SDA  (via drill 0.25)
  Top 0.254: U4.1 30.75,2.68 31.24,3.17 31.24,5.33 30.86,5.71 29.84,5.71 29.34,6.22 29.34,7.24 29.72,7.62 29.72,8.26 29.34,8.64 29.34,21.46 | J5.14 23.88,33.91 v25.53,35.56 | v27.43,25.4 27.43,25.73 R6.1 | 29.34,21.46 v28.45,22.35 | v34.04,19.05 31.75,19.05 29.34,21.46 | v37.85,16.76 38.03,16.95 U3.1 | U9.SDA 43.24,18.86 v41.15,16.76
  Bottom 0.254: v25.53,35.56 25.27,35.31 25.27,27.56 v27.43,25.4 27.98,24.85 U5.18 27.98,22.82 v28.45,22.35 | v34.04,19.05 36.32,16.76 v37.85,16.76 v41.15,16.76
VCC  (via drill 0.2, 0.25)
  Top 0.203: C8.1 34,29.76 U2.8 | 2.03,55.24 P9/P8.P9_3 0.76,54.1 0.76,16.76 1.52,16 v5.08,16
  Top 0.254: U4.5 26.8,3.68 26.42,4.06 26.42,4.95 26.67,5.21 27.43,5.21 28.32,6.1 28.32,20.7 v28.45,20.83 | C6.1 24.53,26.76 U1.1 23.81,28.01 23.56,28.26 23.04,28.78 C16.1 | U1.15 23.75,29.21 | 23.75,29.21 23.29,29.21 C16.1 | C16.1 C7.1 | U1.14 24.25,29.71 23.75,29.21 | 34.92,26.67 U2.1 35.87,26.69 C3.1 35.89,29.54 v36.83,30.48 34.72,30.48 C8.1 | R2.2 41.07,19.12 v41.15,19.05 | C9.1 39.12,19.51 v39.12,18.67 U3.3 | C5.1 31.56,29.03 U2.13 | v30.23,18.8 30.3,18.72 R8.2 C10.1 30.04,16.51 29.78,16.26 29.78,14.7 U8.5 30.7,13.49
  Top 0.406: R6.2 R7.2 30.23,28.25 | 30.23,37.85 30.23,28.25 | 21.84,27.81 23.11,27.81 23.56,28.26 | 30.23,28.25 30.53,28.55 30.53,28.57 C5.1 | R2.2 41.07,23.93 U6.VCC 44.88,24.84 R4.2 44.96,22.02 44.96,19.3 45.4,18.86 U9.VA 45.92,18.35 46.23,18.03 48.19,18.03 | P9/P8.P9_4 P9/P8.P9_3 | R5.1 C12.1 14.97,56.01 U7.A2 12.63,55.88 11.68,55.88 11.18,55.37 v10.16,55.37 | U7.VCC 7.56,53.28 v6.86,52.58 | 30.7,13.49 31.24,12.95 31.24,11.76 R3.2 | C11.1 48.19,18.03 | 48.19,18.03 C15.1
  Top 0.61: v13.72,18.54 J2.1 17.78,18.54 v21.84,22.61 21.84,27.81 20.95,27.81 20.07,28.7 20.07,32.64 17.27,35.43 v17.27,36.32 18.8,37.85 30.23,37.85 38.35,37.85 39.12,38.61 v39.12,39.12 J5.1
  Bottom 0.203: J1.1 10.67,18.48 10.67,18.03 9.4,16.76 5.84,16.76 v5.08,16
  Bottom 0.254: v13.72,18.54 J1.1 | U5.1 38.44,33.86 38.1,33.53 38.1,31.75 v36.83,30.48 | v41.15,19.05 40.77,18.67 v39.12,18.67 | v30.23,18.8 30.23,19.81 29.34,20.7 28.57,20.7 v28.45,20.83
  Bottom 0.406: U5.1 43.86,33.86 47.24,30.48 47.24,27.43 46.1,26.29 U6.VCC | P9/P8.P9_4 6.1,55.37 | 6.1,55.37 v10.16,55.37 | 6.1,55.37 5.84,55.12 5.84,52.83 6.1,52.58 v6.86,52.58 6.86,51.56 J6.1
  Bottom 0.61: U5.1 39.76,38.47 v39.12,39.12 | v17.27,36.32 18.03,37.08 J3.1 | v28.45,20.83 23.62,20.83 v21.84,22.61
VDD
  Top 0.406: P9/P8.P9_6 P9/P8.P9_5

### Text on the board
tPlace: Observer | B. Campbell / N. Jackson / C. Kreng | 2015/04/07 | X | Y | Z | Observer | B | B. Campbell / N. Jackson / C. Kreng | 2015/04/07
tNames: EEPROM / WRITE | CHIPSELECT